# EAGLE design BoardIR (EAGLE 9.0.1)
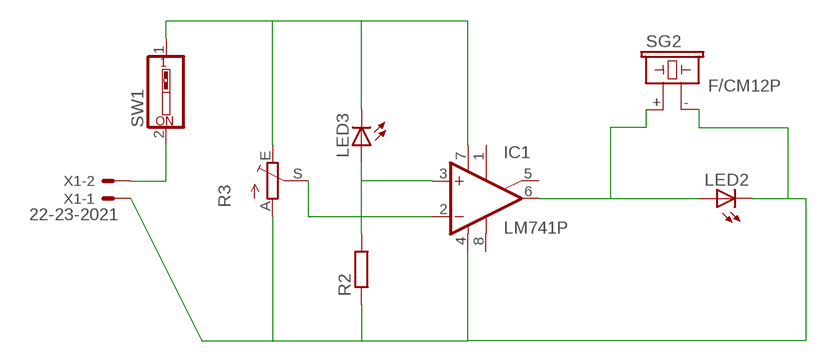
[diagram p0: schematic, sheet 1]

## Parts
IC1  LM741P  [DIL08]
LED2  LED5MM  [LED5MM]
LED3  LED5MM  [LED5MM]
R2  R-EU_0204/5  [0204/5]
R3  TRIM_EU-CA6V  [CA6V]
SG2  F/CM12P  [F/CM12P]
SW1  SW_DIP-1  [EDG-01]
X1  22-23-2021  [22-23-2021]

## Nets
N$1: IC1.3(+IN) LED3.A R2.2
N$2: IC1.2(-IN) R3.S
N$3: IC1.4(V-) LED2.K(C) R2.1 R3.A SG2.- X1.1
N$4: IC1.7(V+) LED3.K(C) R3.E SW1.1
N$5: IC1.6(OUT) LED2.A SG2.+
N$7: SW1.2 X1.2
Unconnected: IC1.1(ON1) IC1.5(ON2) IC1.8(OPT)

## Library data of the parts
IC1 = linear:*741: OP AMP
LED2 LED3 = led:LED: LED OSRAM: - CHIPLED LG R971, LG N971, LY N971, LG Q971, LY Q971, LO R971, LY R971 LH N974, LH R974 LS Q976, LO Q976, LY Q976 LO Q996 - Hyper CHIPLED LW Q18S LB Q993, LB Q99A, LB R99A - SideLED LS A670, LO A670, LY A670, LG A670, LP A670 LB A673, LV A673, LT A673, LW A673 LH A674 LY A675 LS A676, LA A676, LO A676, LY A676, LW A676 LS A679, LY A679, LG A679 - Hyper Micro SIDELED® LS Y876, LA Y876, LO Y876, LY Y876 LT Y87S - SmartLED LW L88C, LW L88S LB L89C, LB L89S, LG L890 LS L89K, LO L89K, LY L89K LS L896, LA L896, LO L896, LY L896 - TOPLED LS T670, LO T670, LY T670, LG T670, LP T670 LSG T670, LSP T670, LSY T670, LOP T670, LYG T670 LG T671, LOG T671, LSG T671 LB T673, LV T673, LT T673, LW T673 LH T674 LS T676, LA T676, LO T676, LY T676, LB T676, LH T676, LSB T676, LW T676 LB T67C, LV T67C, LT T67C, LS T67K, LO T67K, LY T67K, LW E67C LS E67B, LA E67B, LO E67B, LY E67B, LB E67C, LV E67C, LT E67C LW T67C LS T679, LY T679, LG T679 LS T770, LO T770, LY T770, LG T770, LP T770 LB T773, LV T773, LT T773, LW T773 LH T774 LS E675, LA E675, LY E675, LS T675 LS T776, LA T776, LO T776, LY T776, LB T776 LHGB T686 LT T68C, LB T68C - Hyper Mini TOPLED® LB M676 - Mini TOPLED Santana® LG M470 LS M47K, LO M47K, LY M47K Source: http://www.osram.convergy.de LUXEON: - LUMILED® LXK2-PW12-R00, LXK2-PW12-S00, LXK2-PW14-U00, LXK2-PW14-V00 LXK2-PM12-R00, LXK2-PM12-S00, LXK2-PM14-U00 LXK2-PE12-Q00, LXK2-PE12-R00, LXK2-PE12-S00, LXK2-PE14-T00, LXK2-PE14-U00 LXK2-PB12-K00, LXK2-PB12-L00, LXK2-PB12-M00, LXK2-PB14-N00, LXK2-PB14-P00, LXK2-PB14-Q00 LXK2-PR12-L00, LXK2-PR12-M00, LXK2-PR14-Q00, LXK2-PR14-R00 LXK2-PD12-Q00, LXK2-PD12-R00, LXK2-PD12-S00 LXK2-PH12-R00, LXK2-PH12-S00 LXK2-PL12-P00, LXK2-PL12-Q00, LXK2-PL12-R00 Source: www.luxeon.com KINGBRIGHT: KA-3528ASYC Source: www.kingbright.com
R2 = rcl:R-EU_: RESISTOR, European symbol; SPICEPREFIX: R
R3 = pot:TRIM_EU-: POTENTIOMETER
SG2 = buzzer:F/CM12P: BUZZER Source: Buerklin; OC_FARNELL: unknown; OC_NEWARK: unknown
SW1 = special:SW_DIP-1: DIP SWITCH
X1 = con-molex:22-23-2021: .100" (2.54mm) Center Header - 2 Pin; MF: MOLEX; MPN: 22-23-2021; OC_FARNELL: 1462926; OC_NEWARK: 25C3832

## Board
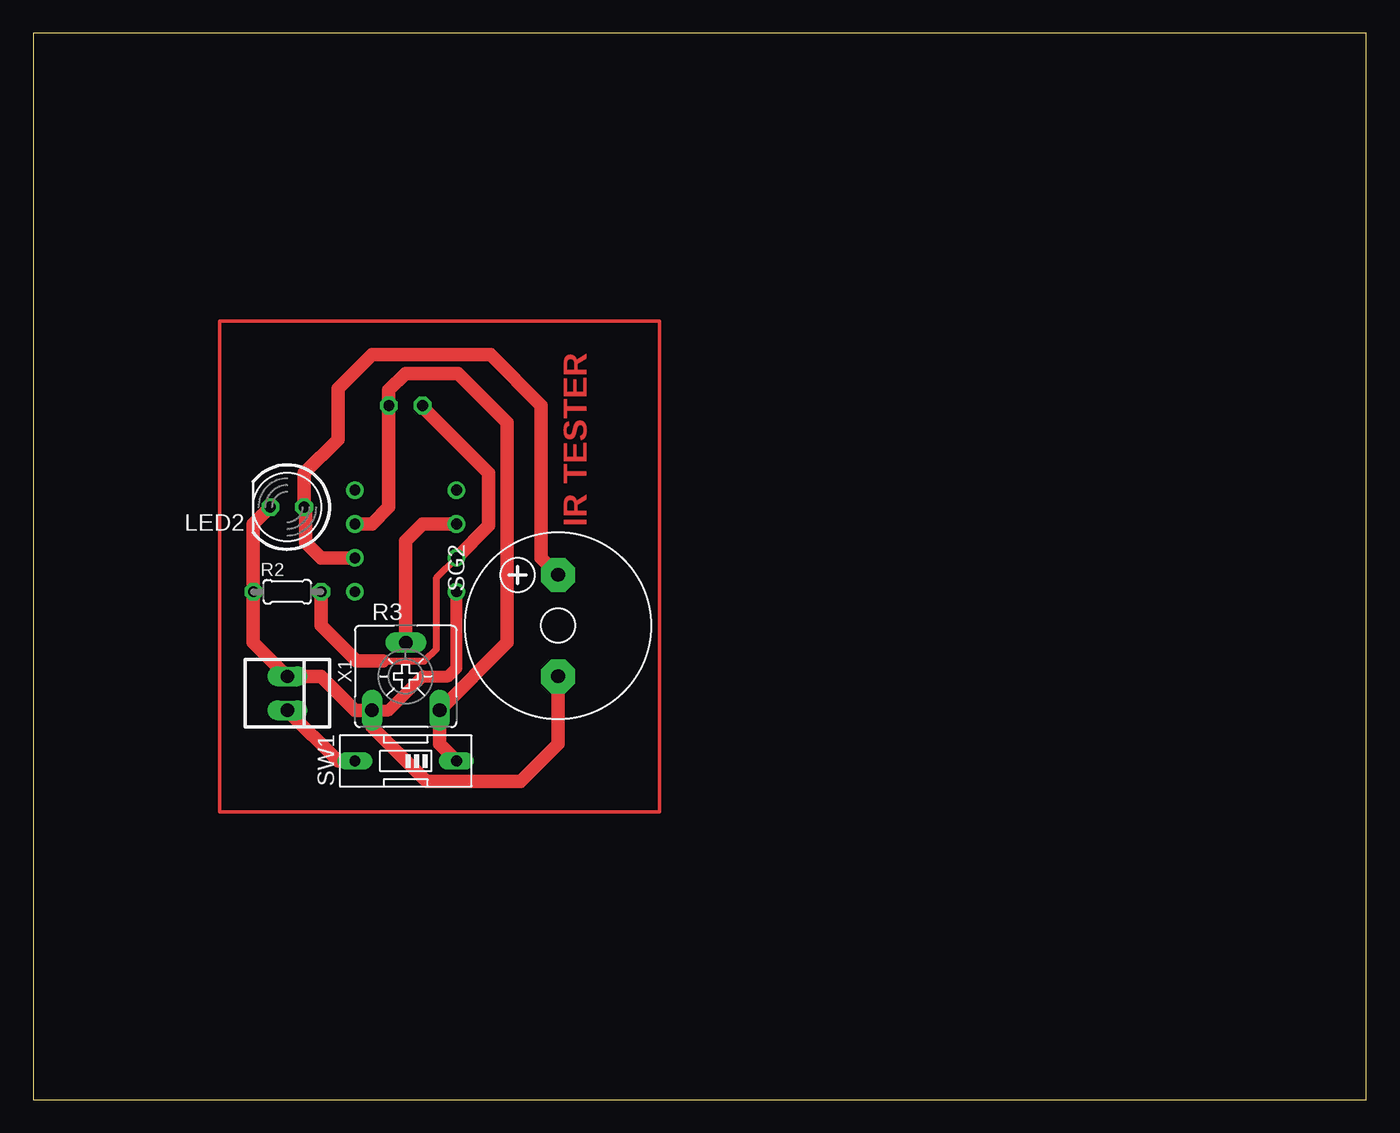
[diagram p1: board, top side]
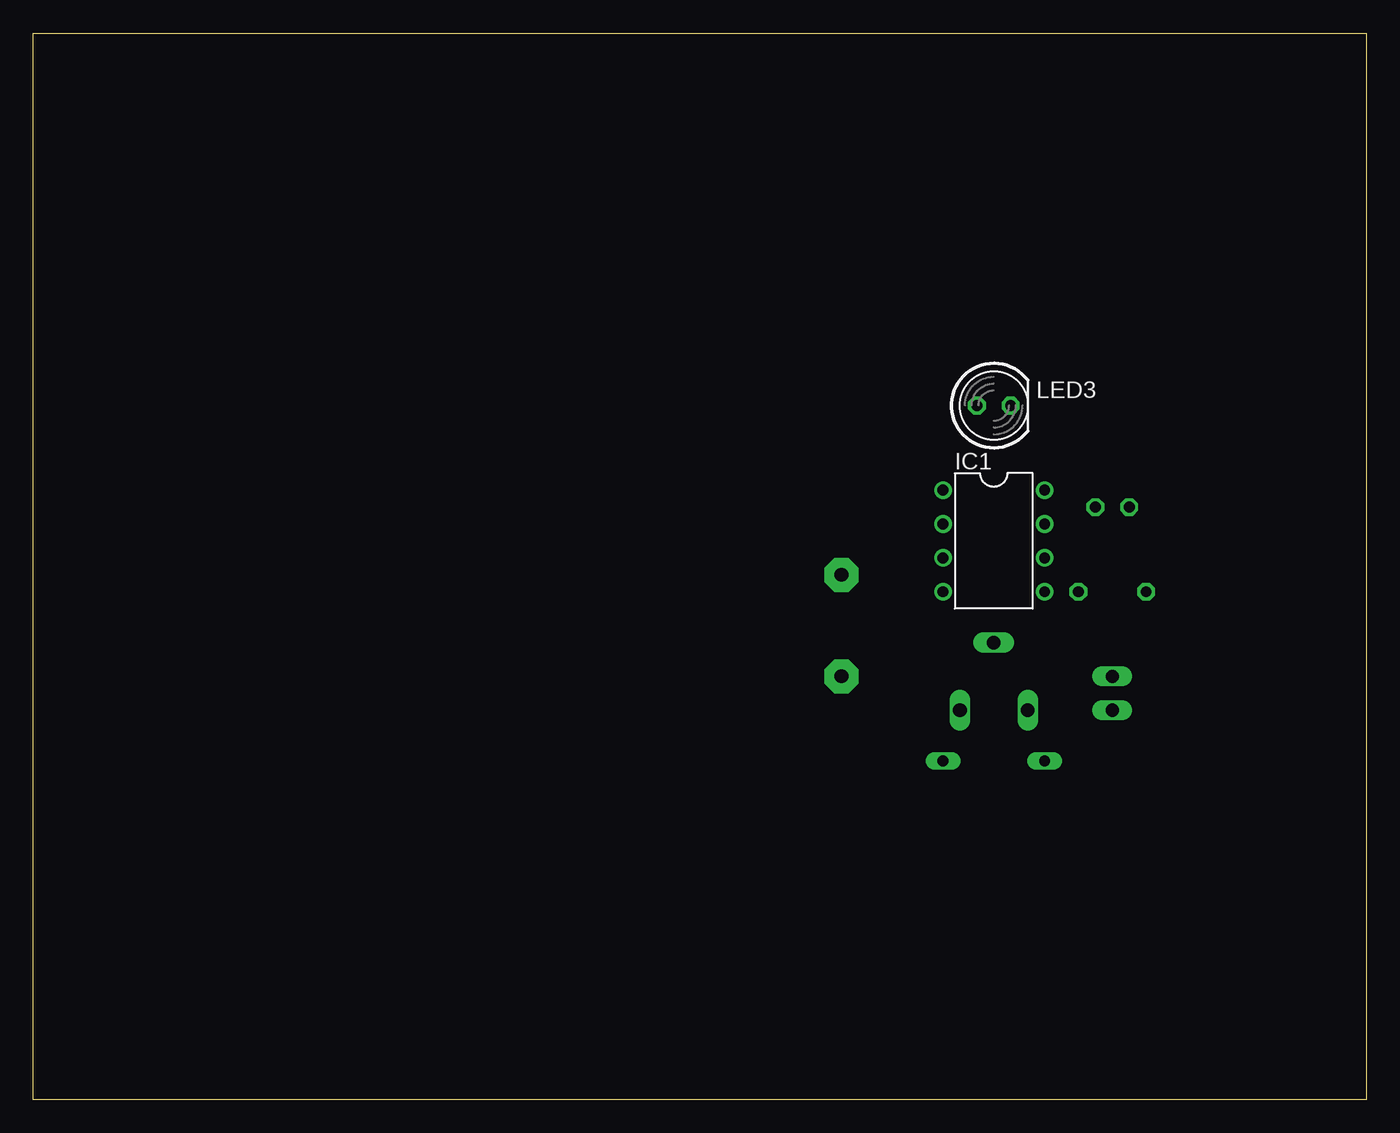
[diagram p2: board, bottom side, seen from below]

Size 100 x 80 mm. Coordinates in mm from the lower left corner, seen from the top.
Outline: 0,0 100,0 100,80 0,80 0,0
Copper layers (1*16): Top 0.035mm / dielectric 1.5mm / Bottom 0.035mm
Design rules "default *": minimum track width 20mil, minimum drill 0.35mm, track to track 15mil, track to pad 15mil, pad to pad 6mil, via to via 6mil, smd to smd 6mil, copper to edge 40mil, drill to drill 6mil, minimum pad ring 10mil, minimum via ring 8mil, stop-mask expansion 4mil, vias tented up to drill 0mil, thermal gap 10mil

### Footprints (pad centres in the part's own frame; a part is rotated, then mirrored left to right if it is on the bottom)
DIL08 = drill 0.813 pad 1.27: 1 -3.81,-3.81; 2 -1.27,-3.81; 3 1.27,-3.81; 4 3.81,-3.81; 5 3.81,3.81; 6 1.27,3.81; 7 -1.27,3.81; 8 -3.81,3.81
LED5MM = drill 0.813 octagon: A -1.27,0; K 1.27,0
0204/5 = drill 0.813 octagon: 1 -2.54,0; 2 2.54,0
CA6V = drill 1.016 long: A -2.54,-2.54; E 2.54,-2.54; S 0,2.54
F/CM12P = drill 1.016 pad 2.54 octagon: + 3.81,0; - -3.81,0
EDG-01 = drill 0.813 long: 1 0,-3.81; 2 0,3.81
22-23-2021 = drill 1 long: 1 -1.27,0; 2 1.27,0

### Placement (x,y rotation side)
IC1  27.94,41.91 270 bottom
LED2  19.05,44.45 180 top
LED3  27.94,52.07 0 bottom
R2  19.05,38.1 0 top
R3  27.94,31.75 0 top
SG2  39.37,35.56 90 top
SW1  27.94,25.4 90 top
X1  19.05,30.48 270 top

### Tracks (layer width: path | path; a pad name or v marks a point on that pad's centre or on a via)
N$1
  Top 0.508: 26.23,32.89 29.34,32.89 30.23,33.78 30.23,39.12 IC1.3
  Top 1.016: IC1.3 34.16,43.05 34.16,46.99 29.21,51.94 LED3.A | R2.2 21.59,35.56 24.26,32.89 26.23,32.89
N$2
  Top 1.016: R3.S 27.94,41.91 29.21,43.18 IC1.2
N$3
  Top 0.508: 16.89,38.23 R2.1 | 25.78,29.34 R3.A 25.34,29.34 | 19.11,31.56 X1.1
  Top 0.889: R3.A 26.67,29.21 29.21,31.75 31.13,31.75 31.75,32.37 IC1.4
  Top 1.016: LED2.K 16.51,43.18 R2.1 16.51,34.29 X1.1 | 19.11,31.56 19.3,31.75 21.59,31.75 24.13,29.21 R3.A 25.4,27.94 29.49,23.85 36.55,23.85 39.37,26.67 SG2.-
N$4
  Top 0.508: 30.67,29.34 R3.E | 26.67,52.45 LED3.K
  Top 1.016: SW1.1 30.48,26.67 R3.E 35.56,34.29 35.56,50.8 31.88,54.48 27.94,54.48 26.67,53.21 LED3.K 26.67,44.45 25.4,43.18 IC1.7
N$5
  Top 0.508: 20.45,44.45 LED2.A
  Top 1.016: LED2.A 20.32,46.99 22.86,49.53 22.86,53.34 25.4,55.88 34.29,55.88 38.1,52.07 38.1,40.64 SG2.+ | 20.45,44.45 20.45,41.78 21.59,40.64 IC1.6
N$6
  Top 0.254: 13.97,21.59 46.99,21.59 46.99,58.42 13.97,58.42 13.97,21.59
N$7
  Top 1.016: X1.2 22.86,25.4 SW1.2

### Text on the board
Top: IR TESTER